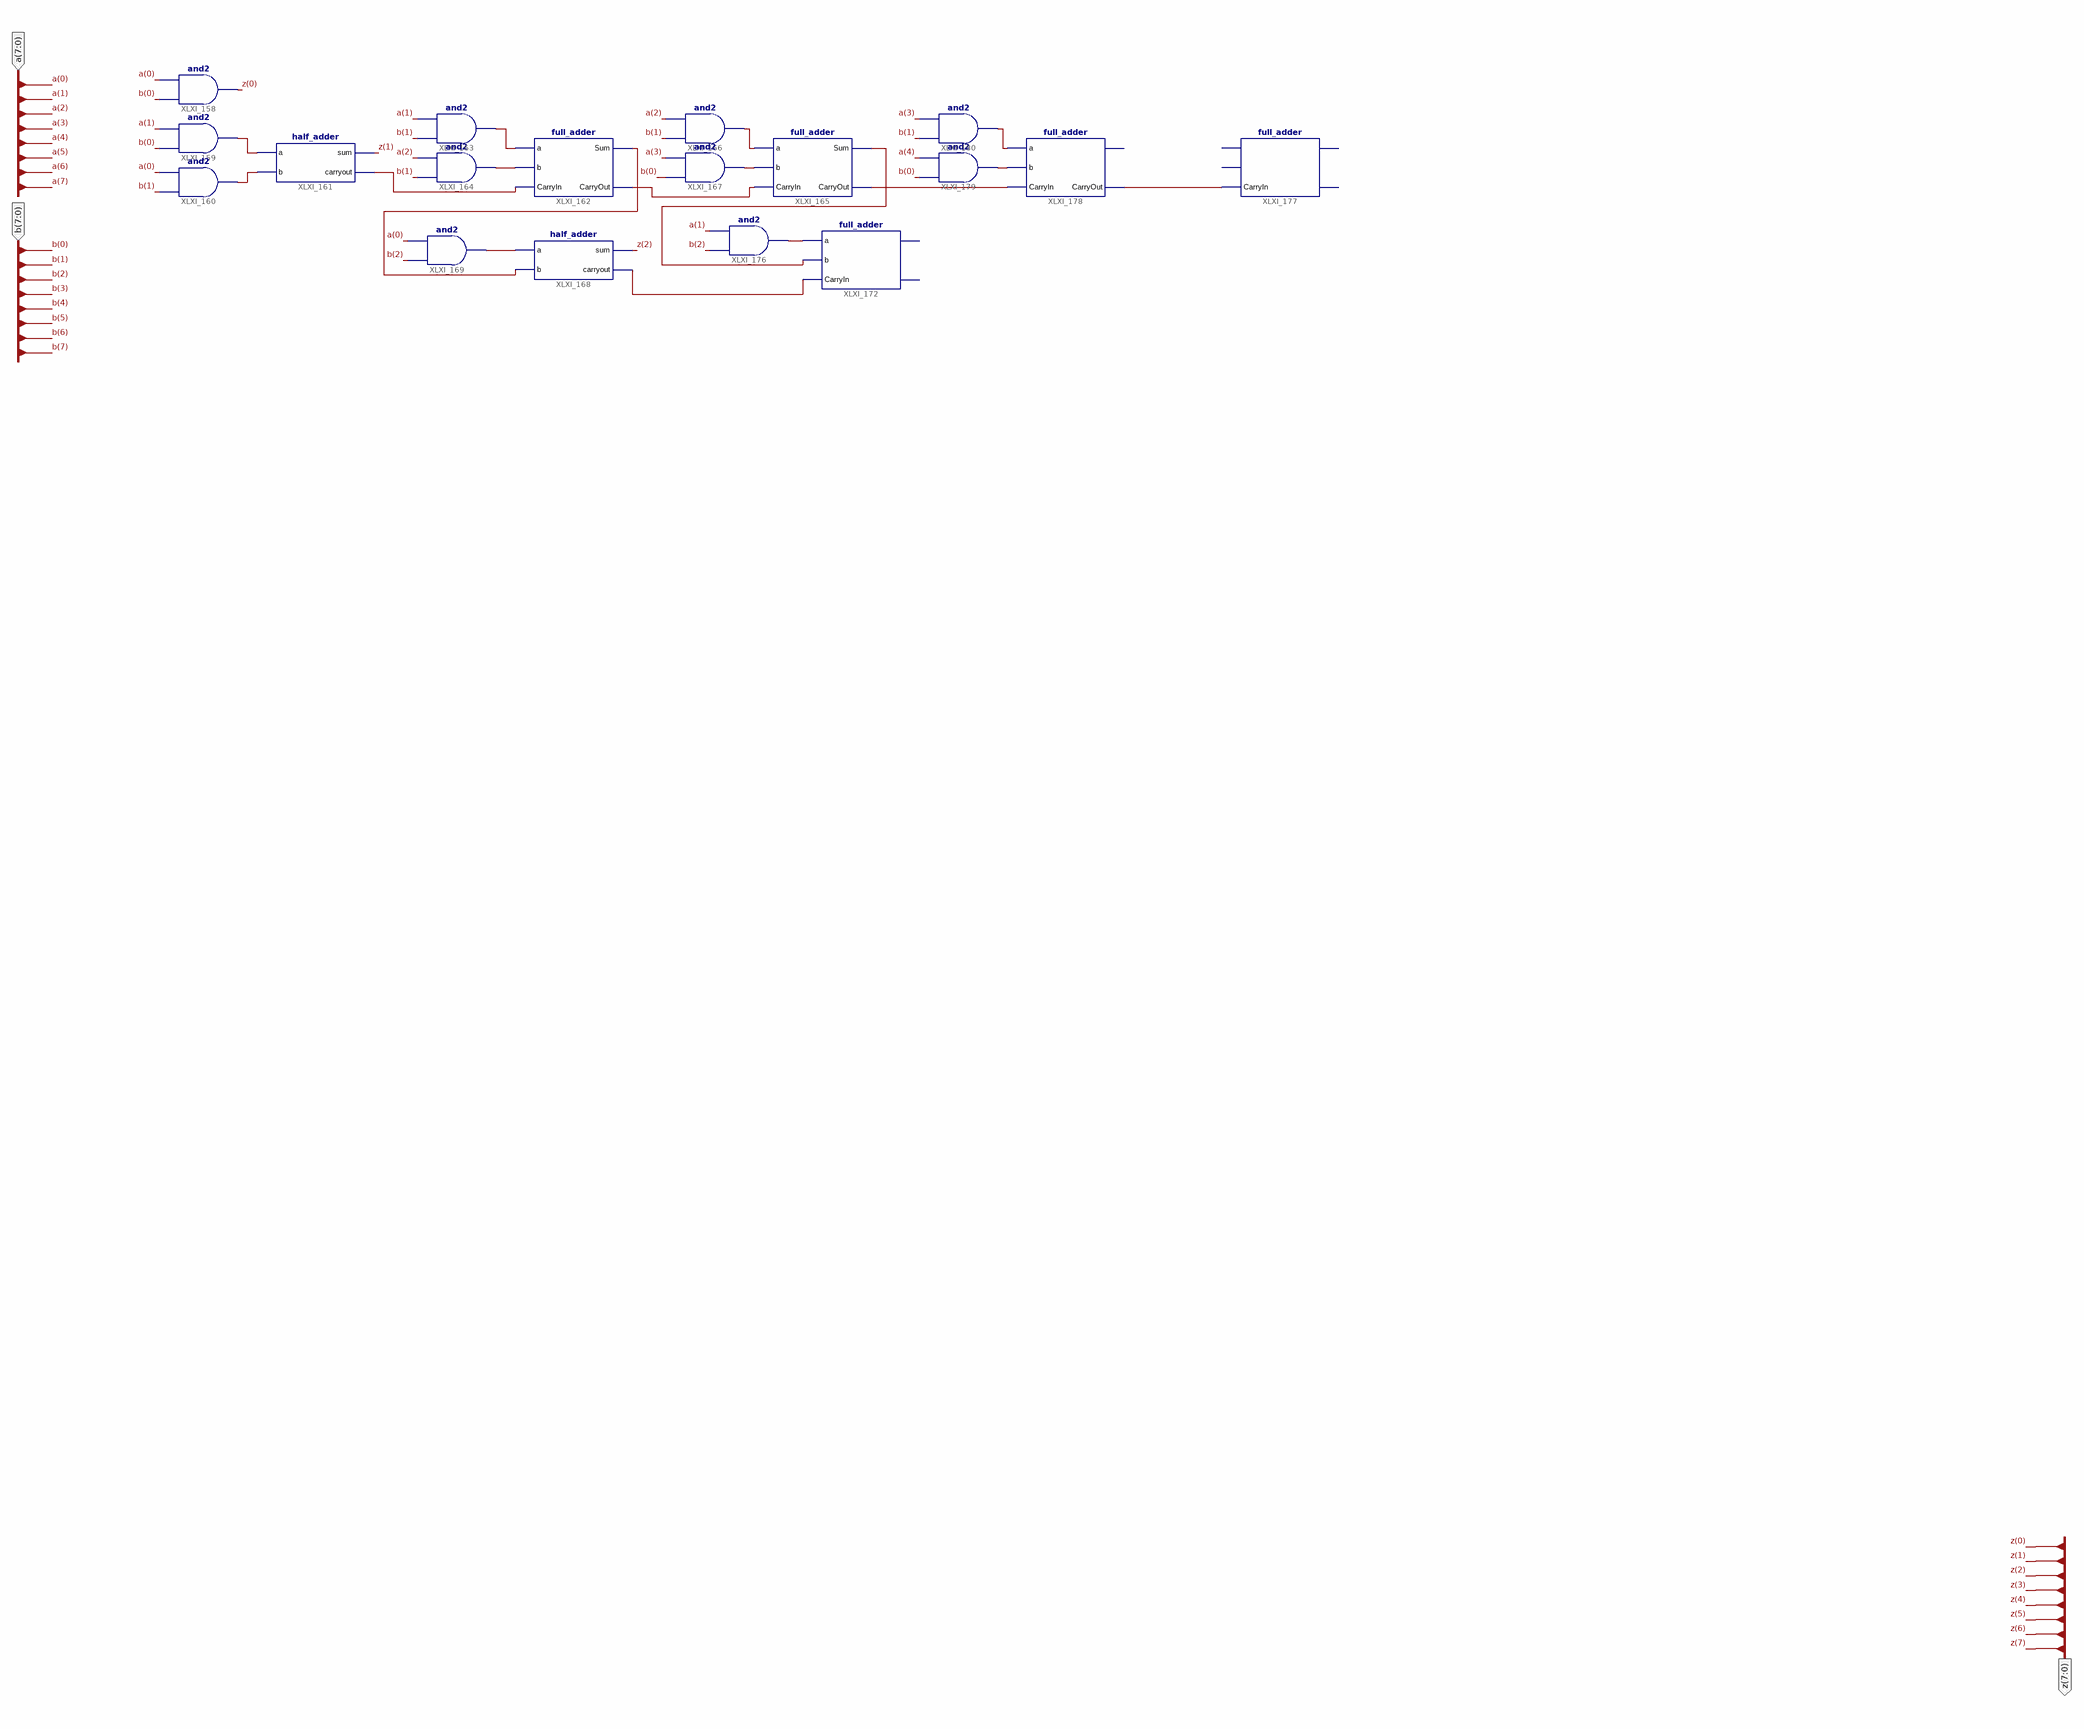
[diagram p0: schematic sheet 1]
// Xilinx ISE schematic multiplier_eight_bit.sch (spartan6) as structural Verilog: 18 symbols, 3 ports
module multiplier_eight_bit (
  input  [7:0] a,
  input  [7:0] b,
  output [7:0] z
);

  wire XLXN_547, XLXN_548, XLXN_550, XLXN_555, XLXN_556, XLXN_561, XLXN_562, XLXN_569, XLXN_579, XLXN_580,
       XLXN_583, XLXN_590, XLXN_596, XLXN_599, XLXN_600, XLXN_605, XLXN_606;

  and XLXI_158 (z[0], b[0], a[0]);
  and XLXI_159 (XLXN_547, b[0], a[1]);
  and XLXI_160 (XLXN_548, b[1], a[0]);
  half_adder XLXI_161 (.a(XLXN_547), .b(XLXN_548), .sum(z[1]), .carryout(XLXN_550));
  full_adder XLXI_162 (.a(XLXN_555), .b(XLXN_556), .CarryIn(XLXN_550), .Sum(XLXN_562), .CarryOut(XLXN_561));
  and XLXI_163 (XLXN_555, b[1], a[1]);
  and XLXI_164 (XLXN_556, b[1], a[2]);
  full_adder XLXI_165 (.a(XLXN_579), .b(XLXN_580), .CarryIn(XLXN_561), .Sum(XLXN_596), .CarryOut(XLXN_583));
  and XLXI_166 (XLXN_579, b[1], a[2]);
  and XLXI_167 (XLXN_580, b[0], a[3]);
  half_adder XLXI_168 (.a(XLXN_569), .b(XLXN_562), .sum(z[2]), .carryout(XLXN_590));
  and XLXI_169 (XLXN_569, b[2], a[0]);
  full_adder XLXI_172 (.a(XLXN_599), .b(XLXN_596), .CarryIn(XLXN_590));  // open: Sum, CarryOut
  and XLXI_176 (XLXN_599, b[2], a[1]);
  full_adder XLXI_177 (.CarryIn(XLXN_606));  // open: a, b, Sum, CarryOut
  full_adder XLXI_178 (.a(XLXN_605), .b(XLXN_600), .CarryIn(XLXN_583), .CarryOut(XLXN_606));  // open: Sum
  and XLXI_179 (XLXN_600, b[0], a[4]);
  and XLXI_180 (XLXN_605, b[1], a[3]);
endmodule
